# EasyEDA schematic Schematic.json
TITLE: RPI_Sensor_HAT; REV: 1.0; Date: 2019-09-14; Sheet: 1/1; Drawn By: leaplu
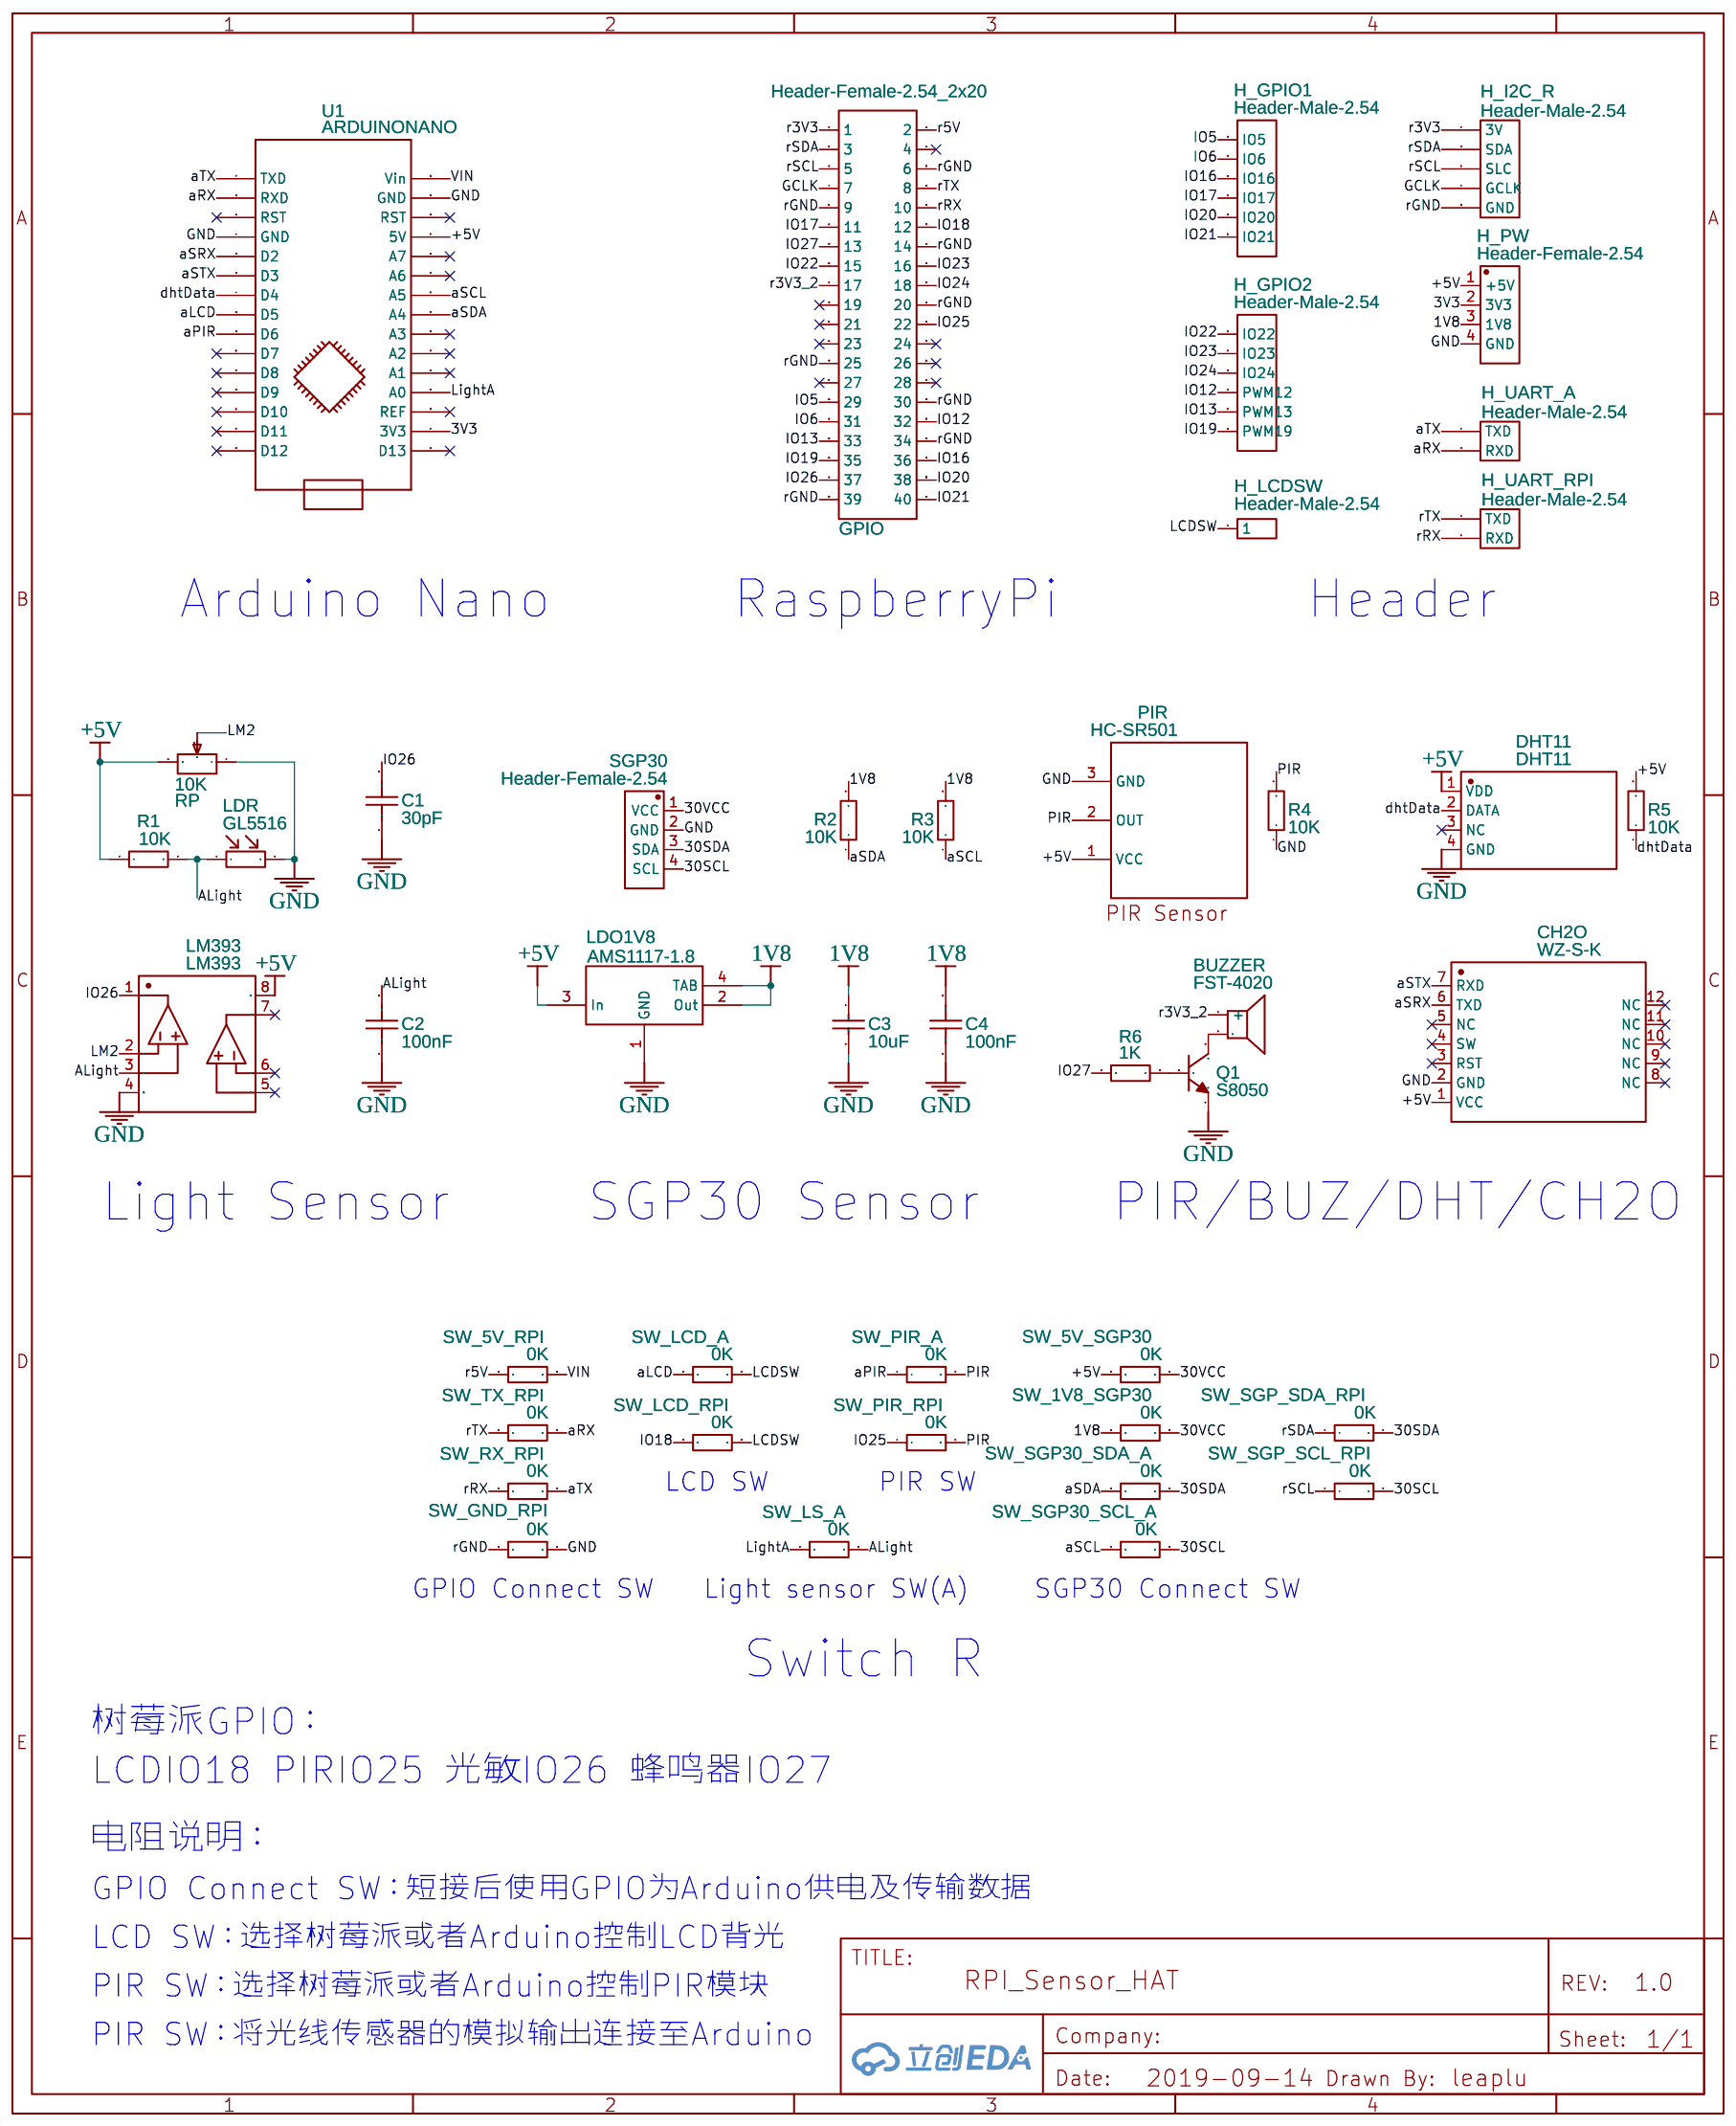
[diagram p0: schematic sheet]

## Parts
BUZZER  FST-4020  [BUZ-SMD_L4.0-W4.0-P3.50-L]
C1  30pF  [0603]
C2  100nF  [0603]
C3  10uF  [0603]
C4  100nF  [0603]
CH2O  WZ-S-K  [WZ-S-K]
DHT11  DHT11  [DHT11]
GPIO  Header-Female-2.54_2x20  [HDR-TH_40PIN-V-ROW2-COL20-FEMALE-PITCH2.54]
H_GPIO1  Header-Male-2.54  [HDR-TH_6P-P2.54-V]
H_GPIO2  Header-Male-2.54  [HDR-TH_6P-P2.54-V]
H_I2C_R  Header-Male-2.54  [HDR-5X1/2.54]
H_LCDSW  Header-Male-2.54  [HDR-TH_1P-P2.54-V-M]
H_PW  Header-Female-2.54  [HDR-TH_4P-P2.54-V]
H_UART_A  Header-Male-2.54  [HDR-TH_2P-P2.54-V-M]
H_UART_RPI  Header-Male-2.54  [HDR-TH_2P-P2.54-V-M]
LDO1V8  AMS1117-1.8  [SOT-223]
LDR  GL5516  [RES-PHOTO_CDS]
LM393  LM393  [SOP8]
PIR  HC-SR501  [HDR-TH_3P-P2.54-V]
Q1  S8050  [SOT-23(SOT-23-3)]
R1  10K  [R0603]
R2  10K  [R0603]
R3  10K  [R0603]
R4  10K  [R0603]
R5  10K  [R0603]
R6  1K  [R0603]
RP  10K  [RES-ADJ_3362P]
SGP30  Header-Female-2.54  [HDR-TH_4P-P2.54-V]
SW_1V8_SGP30  0K  [R0603]
SW_5V_RPI  0K  [R0603]
SW_5V_SGP30  0K  [R0603]
SW_GND_RPI  0K  [R0603]
SW_LCD_A  0K  [R0603]
SW_LCD_RPI  0K  [R0603]
SW_LS_A  0K  [R0603]
SW_PIR_A  0K  [R0603]
SW_PIR_RPI  0K  [R0603]
SW_RX_RPI  0K  [R0603]
SW_SGP30_SCL_A  0K  [R0603]
SW_SGP30_SDA_A  0K  [R0603]
SW_SGP_SCL_RPI  0K  [R0603]
SW_SGP_SDA_RPI  0K  [R0603]
SW_TX_RPI  0K  [R0603]
U1  ARDUINONANO  [ARDUINO NANO VINCENT]

## Library data of the parts
BUZZER = FST-4020: Supplier: LCSC; Supplier Part: C391027; Manufacturer: FUET; Contributor: LCSC
C1 = CC0603GRNPO9BN300: Supplier: LCSC; Supplier Part: C327012; Manufacturer: YAGEO; Contributor: LCSC
C2 C4 = CC0603KRX7R0BB104: Supplier: LCSC; Supplier Part: C113803; Manufacturer: YAGEO; Contributor: LCSC
C3 = CC0603KRX5R5BB106: Supplier: LCSC; Manufacturer: YAGEO; Supplier Part: C109455
CH2O = -: Supplier: dart; Contributor: leaplu
DHT11 = -: Supplier: LCSC; Supplier Part: C117051; Manufacturer: Aosong (Guangzhou) Elec; Contributor: LCSC
GPIO = -: Supplier: LCSC; Manufacturer: BOOMELE; Manufacturer Part: 2.54mm 2*20PFemale header; image: //image.lceda.cn/szlcsc/C50982.jpg; Supplier Part: C50982
H_GPIO1 H_GPIO2 = Header-Male-2.54_1x6: Supplier: LCSC; Manufacturer: BOOMELE; Supplier Part: C37208
H_I2C_R = -: Supplier Part: C50951; Supplier: LCSC; Manufacturer: ReliaPro; Manufacturer Part: 2.54mm 1*5P Header; image: http://image.lceda.cn/szlcsc/C50951.jpg
H_LCDSW = Header-Male-2.54_1x1: Supplier: LCSC; Manufacturer: ReliaPro; Supplier Part: C81276
H_PW SGP30 = -: Supplier: LCSC; Manufacturer: ReliaPro; Manufacturer Part: Headers  Pins 1*4P; image: http://image.lceda.cn/szlcsc/C59481.jpg; Supplier Part: C59481
H_UART_A H_UART_RPI = -: Supplier: LCSC; Manufacturer: ReliaPro; Manufacturer Part: 2.54mm 1*2P; image: http://image.lceda.cn/szlcsc/C36717.jpg; Supplier Part: C36717
LDO1V8 = -: Supplier: LCSC; Manufacturer: AMS; image: //image.lceda.cn/szlcsc/C6185.jpg; Supplier Part: C6185; LCSC Assembly: Yes; SMT Type: Extend
LDR = GL5516: Supplier: LCSC; Manufacturer: Senba; Supplier Part: C125626
LM393 = -: Supplier: LCSC; Supplier Part: C351428; Manufacturer: PUOLOP; Contributor: LCSC
PIR = -: Contributor: W19961028
Q1 = -: Supplier: LCSC; Manufacturer: Hottech; Contributor: LCSC; Supplier Part: C181158; LCSC Assembly: Yes; SMT Type: Extend
R1-R5 SW_1V8_SGP30 SW_5V_SGP30 SW_SGP30_SCL_A SW_SGP30_SDA_A SW_SGP_SCL_RPI SW_SGP_SDA_RPI = RMC060310K5%N: Supplier: LCSC; Supplier Part: C25804; Manufacturer: UNI-ROYAL; Manufacturer Part: 0603WAF1002T5E; Contributor: LCSC
R6 = RMC06031K5%N: Supplier: LCSC; Supplier Part: C269685; Manufacturer: Tyohm; Contributor: LCSC
RP = 3362P-1-103: Supplier: LCSC; Manufacturer: ReliaPro; Supplier Part: C5047
SW_5V_RPI SW_GND_RPI SW_LCD_A SW_LCD_RPI SW_LS_A SW_PIR_A SW_PIR_RPI SW_RX_RPI SW_TX_RPI = RMC06035.1K5%N: Supplier: LCSC; Supplier Part: C23186; Manufacturer: UNI-ROYAL; Manufacturer Part: 0603WAF5101T5E; Contributor: LCSC
U1 = ARDUINONANO COPY: Manufacturer Part: ArduinoNano; Contributor: frz941010

## Nets
1V8: C3.1 C4.2 H_PW.3(1V8) LDO1V8.2(Out) LDO1V8.4(TAB) R2.2 R3.2 SW_1V8_SGP30.1
3V3: H_PW.2(3V3) U1.17(3V3)
30VCC: SGP30.1(VCC) SW_1V8_SGP30.2 SW_5V_SGP30.2
+5V: CH2O.1(VCC) DHT11.1(VDD) H_PW.1(+5V) LDO1V8.3(In) LM393.8(VDD) PIR.1(VCC) R1.1 R5.2 RP.3 SW_5V_SGP30.1 U1.27(5V)
GND: C1.1 C2.1 C3.2 C4.1 CH2O.2(GND) DHT11.4(GND) H_PW.4(GND) LDO1V8.1(GND) LDR.2 LM393.4(GND) PIR.3(GND) Q1.2 R4.1 RP.1 SGP30.2(GND) SW_GND_RPI.2 U1.4(GND) U1.29(GND)
VIN: SW_5V_RPI.2 U1.30(Vin)
30SCL: SGP30.4(SCL) SW_SGP30_SCL_A.2 SW_SGP_SCL_RPI.2
30SDA: SGP30.3(SDA) SW_SGP30_SDA_A.2 SW_SGP_SDA_RPI.2
aLCD: SW_LCD_A.1 U1.8(D5)
ALight: C2.2 LDR.1 LM393.3 R1.2 SW_LS_A.2
aPIR: SW_PIR_A.1 U1.9(D6)
aRX: H_UART_A.2(RXD) SW_TX_RPI.2 U1.2(RXD)
aSCL: R3.1 SW_SGP30_SCL_A.1 U1.24(A5)
aSDA: R2.1 SW_SGP30_SDA_A.1 U1.23(A4)
aSRX: CH2O.6(TXD) U1.5(D2)
aSTX: CH2O.7(RXD) U1.6(D3)
aTX: H_UART_A.1(TXD) SW_RX_RPI.2 U1.1(TXD)
dhtData: DHT11.2(DATA) R5.1 U1.7(D4)
GCLK: GPIO.7 H_I2C_R.4(GCLK)
IO5: GPIO.29 H_GPIO1.1(IO5)
IO6: GPIO.31 H_GPIO1.2(IO6)
IO12: GPIO.32 H_GPIO2.4(PWM12)
IO13: GPIO.33 H_GPIO2.5(PWM13)
IO16: GPIO.36 H_GPIO1.3(IO16)
IO17: GPIO.11 H_GPIO1.4(IO17)
IO18: GPIO.12 SW_LCD_RPI.1
IO19: GPIO.35 H_GPIO2.6(PWM19)
IO20: GPIO.38 H_GPIO1.5(IO20)
IO21: GPIO.40 H_GPIO1.6(IO21)
IO22: GPIO.15 H_GPIO2.1(IO22)
IO23: GPIO.16 H_GPIO2.2(IO23)
IO24: GPIO.18 H_GPIO2.3(IO24)
IO25: GPIO.22 SW_PIR_RPI.1
IO26: C1.2 GPIO.37 LM393.1
IO27: GPIO.13 R6.1
LCDSW: H_LCDSW.1 SW_LCD_A.2 SW_LCD_RPI.2
LightA: SW_LS_A.1 U1.19(A0)
LM2: LM393.2 RP.2
PIR: PIR.2(OUT) R4.2 SW_PIR_A.2 SW_PIR_RPI.2
r3V3: GPIO.1 H_I2C_R.1(3V)
r3V3_2: BUZZER.1(+) GPIO.17
r5V: GPIO.2 SW_5V_RPI.1
rGND: GPIO.6 GPIO.9 GPIO.14 GPIO.20 GPIO.25 GPIO.30 GPIO.34 GPIO.39 H_I2C_R.5(GND) SW_GND_RPI.1
rRX: GPIO.10 H_UART_RPI.2(RXD) SW_RX_RPI.1
rSCL: GPIO.5 H_I2C_R.3(SLC) SW_SGP_SCL_RPI.1
rSDA: GPIO.3 H_I2C_R.2(SDA) SW_SGP_SDA_RPI.1
rTX: GPIO.8 H_UART_RPI.1(TXD) SW_TX_RPI.1
Net-(BUZZER-2): BUZZER.2 Q1.3
Net-(Q1-1): Q1.1 R6.2

Not connected (* = marked no-connect by the designer): CH2O 3(RST)* 4(SW)* 5(NC)* 8(NC)* 9(NC)* 10(NC)* 11(NC)* 12(NC)*; DHT11 3(NC)*; GPIO 4* 19* 21* 23* 24* 26* 27* 28*; LM393 5* 6* 7*; U1 3(RST)* 10(D7)* 11(D8)* 12(D9)* 13(D10)* 14(D11)* 15(D12)* 16(D13)* 18(REF)* 20(A1)* 21(A2)* 22(A3)* 25(A6)* 26(A7)* 28(RST)*

## Notes on the sheet
- Arduino Nano
- RaspberryPi
- Header
- Light Sensor
- SGP30 Sensor
- PIR/BUZ/DHT/CH2O
- LCD SW
- PIR SW
- GPIO Connect SW
- Light sensor SW(A)
- SGP30 Connect SW
- Switch R
- 树莓派GPIO：
- LCDIO18 PIRIO25 光敏IO26 蜂鸣器IO27
- 电阻说明：
- GPIO Connect SW：短接后使用GPIO为Arduino供电及传输数据
- LCD SW：选择树莓派或者Arduino控制LCD背光
- PIR SW：选择树莓派或者Arduino控制PIR模块
- PIR SW：将光线传感器的模拟输出连接至Arduino
